# Altium project pl2303HXD.PrjPcb
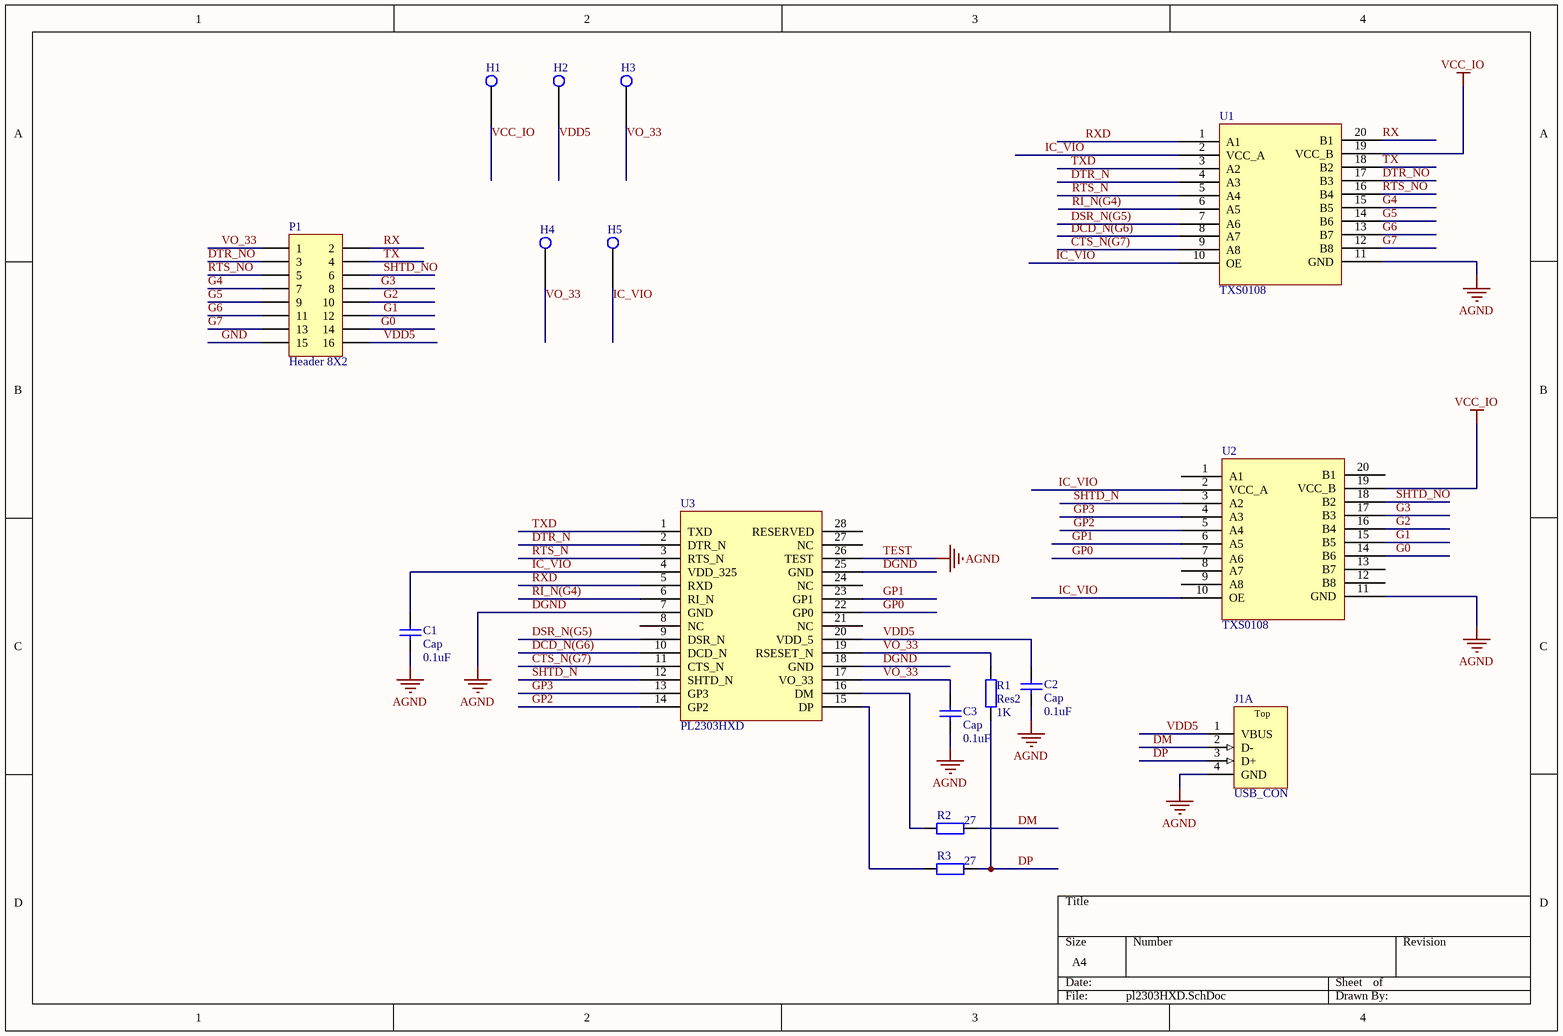
[diagram p0: pl2303HXD.SchDoc]
1 sheet, 16 parts. Net scope: global (net labels, ports and power ports of the same name join across sheets).
Board file: PL2303HXD.PcbDoc

## Sheet pl2303HXD.SchDoc
size A4

### Parts
C1  Cap  value 0.1uF  [CAP-0603]
C2  Cap  value 0.1uF  [CAP-0603]
C3  Cap  value 0.1uF  [CAP-0603]
H1  Header 1  [HDR1*1]  (value not drawn)
H2  Header 1  [HDR1*1]  (value not drawn)
H3  Header 1  [HDR1*1]  (value not drawn)
H4  Header 1  [HDR1*1]  (value not drawn)
H5  Header 1  [HDR1*1]  (value not drawn)
J1  USB_CON  [USB-A]  (part A of 5)
P1  Header 8X2  [HDR2*8]
R1  Res2  value 1K  [RES-0603]
R2  value 27  [RES-0603]  (hidden comment: Res2)
R3  value 27  [RES-0603]  (hidden comment: Res2)
U1  TXS0108  [TSSOP20_44MM_065P]
U2  TXS0108  [TSSOP20_44MM_065P]
U3  PL2303HXD  [SSOP28]

### Nets
DGND: C1.2 C2.2 C3.2 J1.4(GND) U1.11(GND) U2.11(GND) U3.7(GND) U3.18(GND) U3.25(GND) U3.26(TEST)  [also labelled AGND, TEST]
VCC_IO: H1.1(p) U1.19(VCC_B) U2.19(VCC_B)
CTS_N(G7): U1.9(A8) U3.11(CTS_N)
DCD_N(G6): U1.8(A7) U3.10(DCD_N)
DM: J1.2(D-) R2.2
DP: J1.3(D+) R1.1 R3.2
DSR_N(G5): U1.7(A6) U3.9(DSR_N)
DTR_N: U1.4(A3) U3.2(DTR_N)
DTR_NO: P1.3 U1.17(B3)
G0: P1.14 U2.14(B6)
G1: P1.12 U2.15(B5)
G2: P1.10 U2.16(B4)
G3: P1.8 U2.17(B3)
G4: P1.7 U1.15(B5)
G5: P1.9 U1.14(B6)
G6: P1.11 U1.13(B7)
G7: P1.13 U1.12(B8)
GND: P1.15
GP0: U2.7(A6) U3.22(GP0)
GP1: U2.6(A5) U3.23(GP1)
GP2: U2.5(A4) U3.14(GP2)
GP3: U2.4(A3) U3.13(GP3)
IC_VIO: C1.1 H5.1(p) U1.2(VCC_A) U1.10(OE) U2.2(VCC_A) U2.10(OE) U3.4(VDD_325)
RI_N(G4): U1.6(A5) U3.6(RI_N)
RTS_N: U1.5(A4) U3.3(RTS_N)
RTS_NO: P1.5 U1.16(B4)
RX: P1.2 U1.20(B1)
RXD: U1.1(A1) U3.5(RXD)
SHTD_N: U2.3(A2) U3.12(SHTD_N)
SHTD_NO: P1.6 U2.18(B2)
TX: P1.4 U1.18(B2)
TXD: U1.3(A2) U3.1(TXD)
VDD5: C2.1 H2.1(p) J1.1(VBUS) P1.16 U3.20(VDD_5)
VO_33: C3.1 H3.1(p) H4.1(p) P1.1 R1.2 U3.17(VO_33) U3.19(RSESET_N)
NetR2_1: R2.1 U3.16(DM)
NetR3_1: R3.1 U3.15(DP)

Not connected (* = marked no-connect by the designer): U2 1(A1) 8(A7) 9(A8) 12(B8) 13(B7) 20(B1); U3 8(NC) 21(NC) 24(NC) 27(NC) 28(RESERVED)

### Notes on the sheet
- (in symbol USBx4, part A) Top

### Library data of the parts
C1-C3 = Cap: Capacitor; Published: 8-Jun-2000; LatestRevisionDate: 17-Jul-2002; LatestRevisionNote: Re-released for DXP Platform.; PackageReference: RAD-0.3; Publisher: Altium Limited; PackageDescription: Radial Cap, Thru-Hole; 2 Leads; 0.3 in Pin Spacing
J1 = USBx4: USB 1.1, Right Angle, Thru-Hole, A Type, Receptacle, 4x4x4x4 Position, Fourfold Stacked, Black; ContactMaterial: Phosphor Bronze; ContactPlating: Gold (30) over Nickel (50); TerminationLength: 2.36mm [0.093in.]; PCB_Layout: Complies with manufacturer's recommendation.; DrillSize: Corresponds to nominal value.; PanelGround: Without; Published: 15-Jul-2004; DatasheetDocument: 30-Jul-2002; PackageDocument: 30-Jul-2002; PackageReference: 1470007; Publisher: Altium Limited; HousingMaterial: 30% Glass-Filled Thermoplastic; ComponentLink1Description: Manufacturer Link; ComponentLink1URL: http://www.tycoelectronics.com/; ComponentLink2Description: Packaging Specification; ComponentLink2URL: http://ecommas.tycoelectronics.com/commerce/DocumentDelivery/DDEController?Action=showdoc&DocId=Customer+Drawing%7F1470007%7FO%7Fpdf%7FEnglish%7FENG_CD_1470007_O.pdf
P1 = Header 8X2: Header, 8-Pin, Dual row; LatestRevisionDate: 17-Jul-2002; LatestRevisionNote: Re-released for DXP Platform.; Publisher: Altium Limited
R1-R3 = Res2: Resistor; Published: 8-Jun-2000; LatestRevisionDate: 17-Jul-2002; LatestRevisionNote: Re-released for DXP Platform.; PackageReference: AXIAL-0.4; Publisher: Altium Limited; PackageDescription: Axial Device, Thru-Hole; 2 Leads; 0.4 in Pin Spacing